# Altium project BuckConverter_StepDown_AP63300.PrjPcb
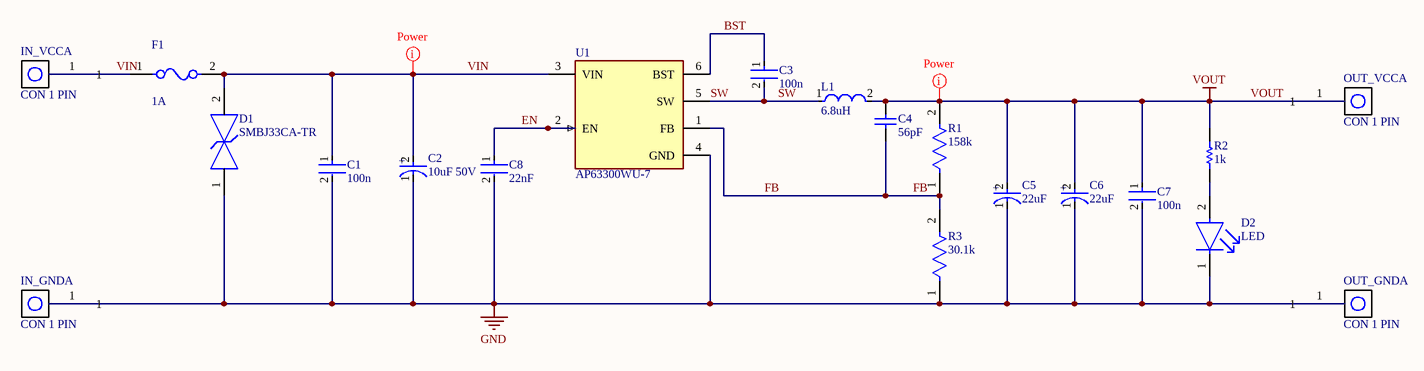
[diagram p0: Sheet.SchDoc]
1 sheet, 20 parts. Net scope: global (net labels, ports and power ports of the same name join across sheets).
Board file: PCB.PcbDoc

## Sheet Sheet.SchDoc
size A4; SheetNumber: 1; SheetTotal: 1

### Parts
C1  100n  [FP-0805-L_2_01_0_2-W_1_25-IPC_B]
C2  10uF 50V  [FP-FKD-MFG]
C3  100n  [FP-0805-L_2_01_0_2-W_1_25-IPC_B]
C4  56pF  [CAPC2013X94X50ML20T25]
C5  22uF  [FP-FKD-MFG]
C6  22uF  [FP-FKD-MFG]
C7  100n  [FP-0805-L_2_01_0_2-W_1_25-IPC_B]
C8  22nF  [FP-C0805C-DN-MFG]
D1  SMBJ33CA-TR  [FP-SMB-CA-MFG]
D2  LED  [FP-LTST-C190GKT-MFG]
F1  1A  [FP-0451-MFG]
IN_GND  CON 1 PIN  [PCBComponent_1]  (part A of 3)
IN_VCC  CON 1 PIN  [PCBComponent_1]  (part A of 3)
L1  6.8uH  [FP-IHLP-2525CZ-FP_2_413x3-MFG]
OUT_GND  CON 1 PIN  [PCBComponent_1]  (part A of 3)
OUT_VCC  CON 1 PIN  [PCBComponent_1]  (part A of 3)
R1  158k  [FP-CRCW0402-e3-IPC_C]
R2  1k  [RESC2013X70X40ML20T20]
R3  30.1k  [FP-CRCW0402-e3-IPC_A]
U1  AP63300WU-7  [FP-TSOT26-IPC_A]

### Nets
GND: C1.2 C2.1(C) C5.1(C) C6.1(C) C7.2 C8.2 D1.1 D2.1(C) IN_GND.1 OUT_GND.1 R3.1 U1.4(GND)
VOUT: C4.2 C5.2(A) C6.2(A) C7.1 L1.2 OUT_VCC.1 R1.2 R2.2
BST: C3.1 U1.6(BST)
EN: C8.1 U1.2(EN)
FB: C4.1 R1.1 R3.2 U1.1(FB)
SW: C3.2 L1.1 U1.5(SW)
VIN: C1.1 C2.2(A) D1.2 F1.1 F1.2 IN_VCC.1 U1.3(VIN)
NetD2_2: D2.2(A) R2.1

### Layout directives
mark named Power: VIN, VOUT

### Notes on the sheet
- (in symbol CMP-2000-06207-2) +
- (in symbol CMP-2000-06209-2) +

### Library data of the parts
C1 C3 C7 = CMP-2007-04172-2: Automotive Ceramic Capacitor, 0805, 100nF, 10%, X7R, 15%, 100V; Voltage Rating (DC): 100V; Case Code (Metric): 2012; Mount: Surface Mount; Length: 2.01mm; Depth: 1.25mm; Lead Free: Lead Free; Ratings: AEC-Q200; Max Operating Temperature: 125°C; Tolerance: 10%; Case/Package: 0805; Width: 0.049inch; Package Quantity: 1; Thickness: 0.055inch; Construction: Flat; Min Operating Temperature: -55°C; REACH SVHC: No SVHC; Number of Pins: 2; Radiation Hardening: No; Capacitance: 100nF; Voltage Rating: 100V; Height: 1.4mm; Series: -; Voltage: 100V; Dielectric: X7R; Termination: SMD/SMT; Case Code (Imperial): 0805; RoHS Compliant: Yes; Packaging: Tape and Reel; Dielectric Material: Ceramic
C2 = CMP-2000-06207-2: CAP ALUM 10UF 20% 50V SMD; Impedance: 880mR; Ripple Current: 165mA; Polarity: Polar; Leakage Current: 3uA; Lead Diameter: 0.65mm; Life (Hours): 2000Hour; REACH SVHC: No SVHC; Series: FK; Max Operating Temperature: 105°C; Radiation Hardening: No; Size: 5.8mm; Ripple Current (AC): 165mA; Lead Free: Lead Free; Voltage: 50V; Contact Plating: Tin; Case/Package: Radial; RoHS Compliant: Yes; Voltage Rating: 50V; Height - Seated (Max): 0.24inch; Package Quantity: 1000; Termination: SMD/SMT; Number of Pins: 2; Mount: Surface Mount; Packaging: Tape and Reel; Length: 5.8mm; Width: 7.8mm; Min Operating Temperature: -55°C; Height: 5.8mm; ESR (Equivalent Series Resistance): 880mR; Capacitance: 10uF; Diameter: 6.3mm; Voltage Rating (DC): 50V; Construction: Cylindrical; Tolerance: 20%; Lead Pitch: 1.8mm
C4 = CMP-2007-04332-1: Manufacturer: AVX Interconnect / Elco; Part Number: 08055A560JAT2-A
C5 C6 = CMP-2000-06209-2: CAP ALUM 22UF 20% 50V SMD; Life (Hours): 2000Hour; Ripple Current: 165mA; ESR (Equivalent Series Resistance): 880mR; Dielectric Material: Aluminium; Leakage Current: 3uA; Polarity: Polar; Radiation Hardening: No; Lead Free: Lead Free; Capacitance: 22uF; Package Quantity: 1000; Width: 7.8mm; Length: 5.8mm; Max Operating Temperature: 105°C; Tolerance: 20%; Height - Seated (Max): 0.24inch; Height: 5.8mm; Voltage Rating: 50V; Diameter: 6.3mm; Series: FK; Voltage: 50V; Termination: SMD/SMT; Construction: Cylindrical; Mount: Surface Mount; Number of Pins: 2; Case/Package: Radial; Packaging: Tape and Reel; Ripple Current (AC): 165mA; REACH SVHC: No SVHC; Min Operating Temperature: -55°C; Contact Plating: Tin; Voltage Rating (DC): 50V; RoHS Compliant: Yes; Impedance: 880mR
C8 = CMP-2007-00338-2: CAP CER 0.022UF 50V X7R 0805; Manufacturer: KEMET; Manufacturer Part Number: C0805C223K5RACTU; Value: 22,000 pF; Material: Ceramic; Tolerance: 0.1; Temperature Coefficient: 30ppm/°C; Automotive: No; Package: C0805C-DN; RoHS: TRUE; Height: 0.88mm; Lead Free: Yes; Temperature Range Low: -55°C; Digikey Description: CAP CER 0.022UF 50V X7R 0805; ComponentLink2Description: Datasheet; Capacitance: 22,000 pF; Mouser Description: Capacitor; Ceramic; Cap; .022uF; Tol 10%; SMT; Vol-Rtg 50V; X7R; Tape and Reel; Device Class L3: Ceramic Capacitors; Category: Cap; Voltage Rating: 50 V; Temperature Characteristic: X7R; Ipc Land Pattern Name: CAPC200125X78; Octopart: https://octopart.com/c0805c223k5ractu-kemet-145968; Device Class L1: Passive Components; Temperature: -55°C to +125°C; ComponentLink2URL: https://content.kemet.com/datasheets/KEM_C1003_C0G_SMD.pdf; Temperature Range High: +125°C; Device Class L2: Capacitors
D1 = CMP-12225-000040-1: TVS DIODE 33V 69.7V SMB; Manufacturer: STMicroelectronics; Direction: Bidirectional; Peak Pulse Current: 11.8A; Peak Pulse Power: 600W; Clamping Voltage: 53.3V; Breakdown Voltage: 36.7V; Number Of Channels: 1; Standoff Height: 0.05mm; Max Junction Temp: +150°C; Lead Free: Yes; Device Class L1: Circuit Protection; Device Class L3: unset; Mouser Description: TVS Diodes - Transient Voltage Suppressors 600W 33V Bidirect; Device Class L2: TVS Diodes; Temperature Range High: +150°C; Temperature: -55°C to +150°C; Temperature Range Low: -55°C; Octopart: https://octopart.com/smbj33ca-tr-stmicroelectronics-347069; Manufacturer Part Number: SMBJ33CA-TR; Automotive: No; ComponentLink2URL: https://www.st.com/resource/en/datasheet/smbj.pdf; RoHS: TRUE; Package: SMB-CA; Category: Diode; ComponentLink2Description: Datasheet; Height: 2.65mm; Reverse Standoff Voltage: 33V; Digikey Description: TVS DIODE 33V 69.7V SMB
D2 = CMP-22017-000005-2: LED GREEN CLEAR CHIP SMD; Dominant Wavelength: 569nm; Reverse Voltage: 5V; Lens Color: Colorless; Viewing Angle: 130°; Voltage: 2V; Forward Current: 30mA; Power Dissipation: 100mW; Luminous Intensity: 6mcd; Number of LEDs: 1; Forward Voltage: 2.1V; Wavelength: 565nm; Test Current: 10mA; Min Operating Temperature: -55°C; Lens Style: Clear; Mount: Surface Mount; Width: 0.8mm; Packaging: Tape and Reel; Lens Transparency: Clear; Case Code (Metric): 1608; Depth: 0.8mm; Case Code (Imperial): 0603; Case/Package: 0603; Number of Pins: 2; Max Operating Temperature: 85°C; Lead Free: Lead Free; Number of Elements: 1; Length: 1.6mm; Height: 0.8mm; Package Quantity: 1; Power Rating: 100mW; Radiation Hardening: No; Illumination Color: Green; Color: Green
F1 = CMP-08605-000061-1: FUSE BRD MNT 1A 125VAC/VDC 2SMD; Manufacturer: Littelfuse Inc; Manufacturer Part Number: 0451001.MRL; Resistance: 0.078Ω; Max Fuse Ac Voltage: 125V; Fuse Interrupt Dc Current: 300A; Fuse I2T: 0.6029A2Sec; Fuse Blow Speed: Fast; Value: 0.078Ω; Fuse Interrupt Ac Current: 50A; RoHS: TRUE; Octopart: https://octopart.com/0451001.mrl-littelfuse-566368; Temperature Range High: +125°C; Temperature: -55°C to +125°C; ComponentLink2Description: Datasheet; Voltage Rating: 125V; Digikey Description: FUSE BRD MNT 1A 125VAC/VDC 2SMD; Mouser Description: Surface Mount Fuses 125V 1A; Fuse Current: 1A; Device Class L1: Circuit Protection; Package: 0451; Lead Free: Yes; Device Class L3: unset; Category: Fuse; Automotive: No; Temperature Range Low: -55°C; ComponentLink2URL: https://www.littelfuse.com/~/media/electronics/datasheets/fuses/littelfuse_fuse_451_453_datasheet.pdf.pdf; Max Fuse Dc Voltage: 125V; Device Class L2: Fuses; Height: 2.94mm
IN_GND IN_VCC OUT_GND OUT_VCC = Connector_3mm
L1 = CMP-02424-000659-1: Commercial Inductors, Low DCR Series 6.8uH 5.5A 46.8mΩ 20%; Core Material: Ferrite; Shielding: Shielded; Self Resonant Frequency: 1MHz; Test Frequency: 100kHz; Saturation Current: 4A; DC Resistance (DCR): 46.8mR; Case Code (Metric): 6363; Current Rating: 5.5A; Lead Free: Lead Free; Packaging: Tape and Reel; Case Code (Imperial): 2525; Max Operating Temperature: 125°C; Width: 0.255inch; RMS Current (Irms): 5.5A; Inductance: 6.8uH; Height - Seated (Max): 0.118inch; Mount: Surface Mount; Depth: 6.72mm; Termination: SMD/SMT; Height: 3mm; Radiation Hardening: No; Max DC Current: 4A; Military Standard: Not; Contact Plating: Tin; Length: 7.24mm; Package Quantity: 2000; Tolerance: 20%; Inductance Tolerance: 20%; Number of Pins: 2; Case/Package: 2525; Min Operating Temperature: -55°C
R1 = CMP-2002-08218-2: RES Thick Film, 158kΩ, 1%, 0.063W, 100ppm/°C, 0402; Max Power Dissipation: 63mW; Voltage Rating (DC): 50V; Resistance: 158kR; Package Quantity: 10; Termination: SMD/SMT; Composition: Thick Film; Length: 1mm; Lead Free: Lead Free; Number of Terminations: 2; Weight: 2.3E-05oz; Number of Pins: 2; Features: Automotive AEC-Q200; Case Code (Imperial): 0402; Contact Plating: Tin; Min Operating Temperature: -55°C; Width: 0.5mm; Case/Package: 0402; Packaging: Tape and Reel; Max Operating Temperature: 155°C; Radiation Hardening: No; Temperature Coefficient: 100ppm/°C; Power Rating: 63mW; Tolerance: 1%; Military Standard: Not; Height: 0.016inch; Case Code (Metric): 1005; Voltage Rating: 50V; Depth: 0.5mm
R2 = CMP-2001-04375-5: Chip Resistor, 1 KOhm, +/- 1%, 0.125 W, -55 to 155 degC, 0805 (2012 Metric), RoHS, Tape and Reel; Manufacturer: Panasonic; Voltage Rating: 150 V; ComponentLink1URL: http://www.panasonic.com/; ComponentLink2Description: Datasheet; REACH SVHC: Yes; ComponentLink1Description: Manufacturer URL; Length: 2 mm; Height: 0.6 mm; Package Quantity: 1; PackageDescription: 2-Pin Surface Mount Device, Body 2 x 1.25 mm; Packaging: Cut Tape; PackageReference: 0805; Max Operating Temperature: 155 degC; Mounting Technology: Surface Mount; ComponentLink2URL: http://industrial.panasonic.com/cdbs/www-data/pdf/RDA0000/AOA0000C86.pdf; DatasheetVersion: 04/2015; Min Operating Temperature: -55 degC; RoHSCompliant: true; Mount: Surface Mount
R3 = CMP-2002-08506-4: RES Thick Film, 30.1kΩ, 1%, 0.063W, 100ppm/°C, 0402; Power Rating: 63mW; Voltage Rating: 50V; Resistance: 30.1kR; Max Operating Temperature: 155°C; Depth: 0.5mm; Composition: Thick Film; Military Standard: Not; Case/Package: 0402; Number of Terminations: 2; Features: Automotive AEC-Q200; Temperature Coefficient: 100ppm/°C; Packaging: Tape and Reel; Min Operating Temperature: -55°C; Contact Plating: Tin; Radiation Hardening: No; Length: 1mm; Case Code (Imperial): 0402; Number of Pins: 2; Tolerance: 1%; Voltage Rating (DC): 50V; Mount: Surface Mount; Weight: 2.3E-05oz; Case Code (Metric): 1005; Package Quantity: 10; Termination: SMD/SMT; Height: 0.35mm; Max Power Dissipation: 63mW; Width: 0.02inch; Lead Free: Lead Free
U1 = CMP-12757-000025-1: DCDC CONV HV BUCK TSOT26